# EAGLE design 280109_Button_PCB_4.0 (EAGLE 9.6.2)
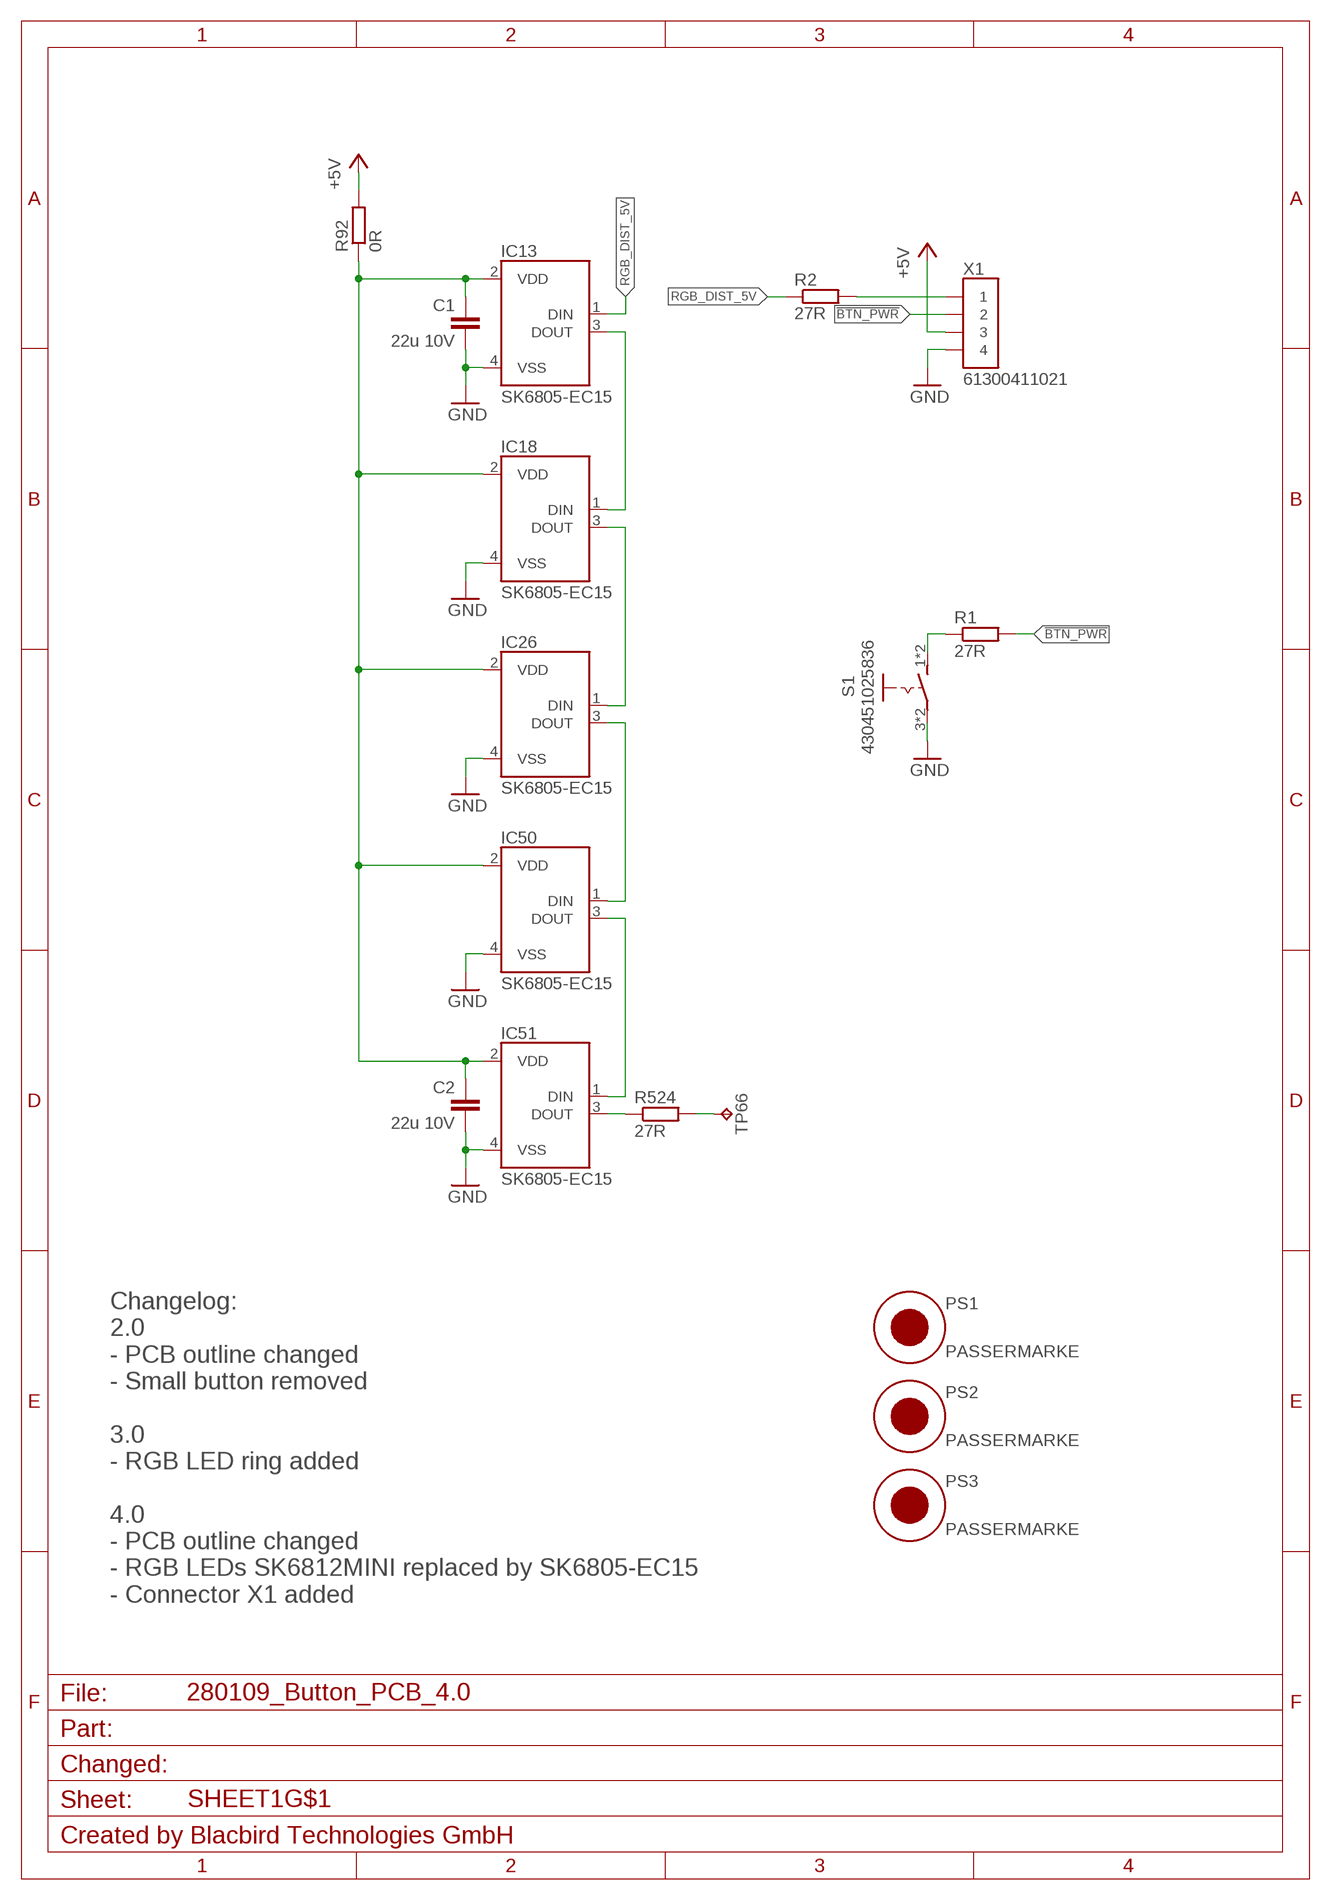
[diagram p0: schematic, sheet 1]

## Parts
C1  22u 10V  C-EUC0805  [C0805]
C2  22u 10V  C-EUC0805  [C0805]
IC13  SK6805-EC15  [SK6805-EC_IPIXEL]
IC18  SK6805-EC15  [SK6805-EC_IPIXEL]
IC26  SK6805-EC15  [SK6805-EC_IPIXEL]
IC50  SK6805-EC15  [SK6805-EC_IPIXEL]
IC51  SK6805-EC15  [SK6805-EC_IPIXEL]
PS1  PASSERMARKE  [PASSERMARKE]
PS2  PASSERMARKE  [PASSERMARKE]
PS3  PASSERMARKE  [PASSERMARKE]
R1  27R  R-EUR0603  [R0603]
R2  27R  R-EUR0603  [R0603]
R92  0R  R-EUR0603  [R0603]
R524  27R  R-EUR0603  [R0603]
S1  430451025836  [430451025836_WUERTH]
TP66  TESTPOINT_VIA_ROUND_0.8MM  [TESTVIA_ROUND_0.8MM]
X1  61300411021  [61300411021_WUERTH]

## Nets
!BTN_PWR: R1.2 X1.2
+5V: R92.2 X1.3
GND: C1.2 C2.2 IC13.4(VSS) IC18.4(VSS) IC26.4(VSS) IC50.4(VSS) IC51.4(VSS) S1.3(P) S1.4(P) X1.4
N$1: R1.1 S1.1(S) S1.2(S)
N$2: R2.2 X1.1
N$14: R524.2 TP66.P$1(TP)
N$21: C1.1 C2.1 IC13.2(VDD) IC18.2(VDD) IC26.2(VDD) IC50.2(VDD) IC51.2(VDD) R92.1
N$23: IC51.3(DOUT) R524.1
N$173: IC50.3(DOUT) IC51.1(DIN)
N$175: IC26.3(DOUT) IC50.1(DIN)
N$176: IC18.3(DOUT) IC26.1(DIN)
N$178: IC13.3(DOUT) IC18.1(DIN)
RGB_DIST_5V: IC13.1(DIN) R2.1

## Notes on the sheet
- Changelog:
  2.0
  - PCB outline changed
  - Small button removed
  
  3.0
  - RGB LED ring added
  
  4.0
  - PCB outline changed
  - RGB LEDs SK6812MINI replaced by SK6805-EC15
  - Connector X1 added

## Library data of the parts
C1 C2 = 03_DT_Passive_Components:C-EU: CAPACITOR, European symbol; CHANGED: 2017-09-12; CREATED: 2017-09-12; DIELECTRIC: X5R; MAX_OP_TEMP: 85°C; MIN_OP_TEMP: -55°C; STATUS: active; TOLERANCE: ±20 %; VOLTAGE: 10.0 V
IC13 IC18 IC26 IC50 IC51 = 2021_blacbird_eagle_lbr:SK6805-EC15: SK6805-EC15, Adafruit NeoPixel RGB LED, 1.50mm L x 1.50mm W Datasheet <https://cdn-shop.adafruit.com/product-files/4492/Datasheet.pdf>; CHANGED: 2021-10-20; CREATED: 2021-10-20; MANUFACTURER: IPIXELS; MAX_OP_TEMP: 85 °C; MIN_OP_TEMP: -40 °C; ROHS: yes; STATUS: active; VOLTAGE: 5.5 V
PS1-PS3 = 07_DT_Miscellaneous:PASSERMARKE; CHANGED: 2017-11-07; CREATED: 2017-11-07
R1 R2 R92 R524 = 03_DT_Passive_Components:R-EU: RESISTOR, European symbol; CHANGED: 2017-09-12; CREATED: 2017-09-12; MAX_OP_TEMP: 70 °C; MIN_OP_TEMP: -55 °C; POWER: 63 mW; STATUS: active; TEMP_COEFF: ±400 ppm/°C; TOLERANCE: ±1 %; VOLTAGE: 50 V
S1 = 05_DT_Electromechanic:430451025836: 430451025836, WS-TASV SMT Tact Switch; CHANGED: 2021-02-24; CREATED: 2021-02-24; CURRENT: 50 mA; MANUFACTURER: Wuerth; MAX_OP_TEMP: 85 °C; MIN_OP_TEMP: -40 °C; ROHS: yes; STATUS: active; VOLTAGE: 12.0 V
TP66 = 07_DT_Miscellaneous:TESTPOINT_VIA_ROUND_0.8MM: Testpoint THT Round 1.5 mm diameter, 0.8 mm hole; CHANGED: 2019-01-16; CREATED: 2019-01-16
X1 = 00_DT_Connectors:61300411021: 61300411021, WR-PHD, 2.54MM PIN HEADER angled, THT, 4 pins; CHANGED: 2021-11-17; CREATED: 2021-11-17; CURRENT: 3.0 A; MANUFACTURER: Wuerth; MAX_OP_TEMP: 105 °C; MIN_OP_TEMP: -40 °C; ROHS: yes; STATUS: active; VOLTAGE: 500 V(AC)

## Board
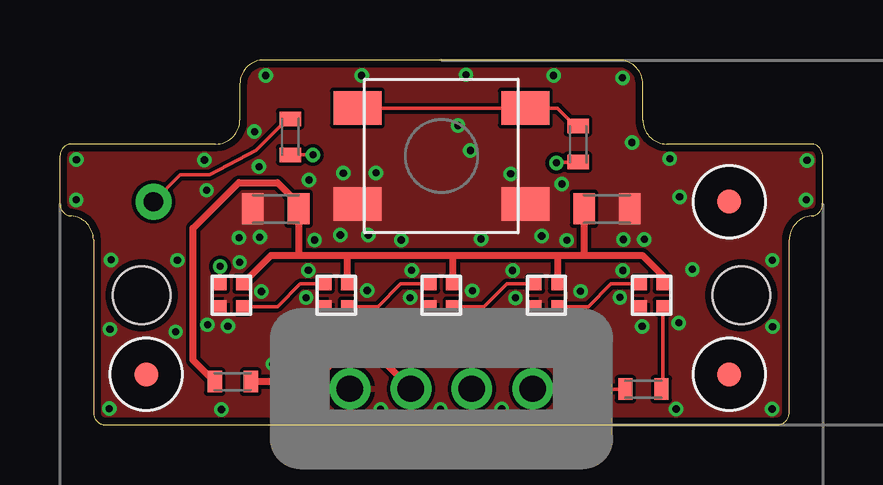
[diagram p1: board, top side]
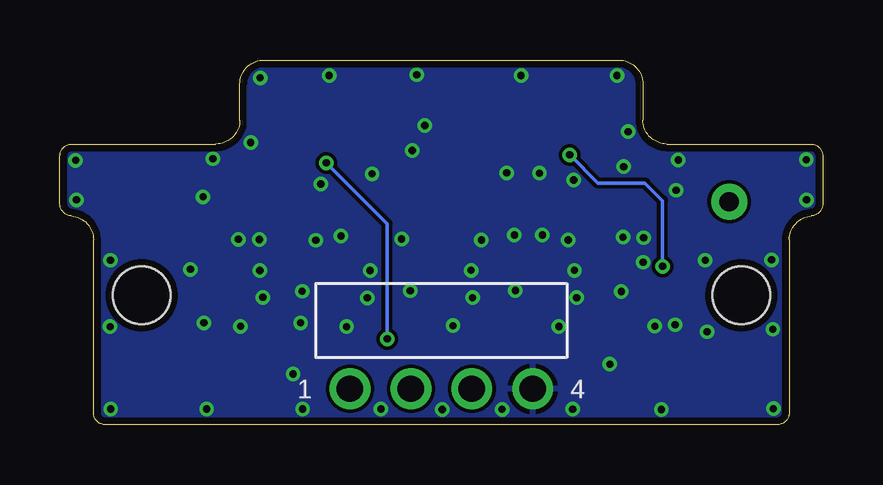
[diagram p2: board, bottom side, seen from below]

Size 31.8 x 15.2 mm. Coordinates in mm from the lower left corner, seen from the top.
Outline: 24.3,12.7 24.3,14.2 arc90 23.3,15.2 8.5,15.2 arc90 7.5,14.2 7.5,12.7 arc-90 6.5,11.7 0.5,11.7 arc90 0,11.2 0,9.2 arc86 0.47,8.7 arc-86 1.4,7.7 1.4,0.5 arc90 1.9,0 29.9,0 arc90 30.4,0.5 30.4,7.7 arc-86 31.33,8.7 arc86 31.8,9.2 31.8,11.2 arc90 31.3,11.7 25.3,11.7 arc-90 24.3,12.7
Copper layers (1*16): Top 0.035mm / dielectric 0.73mm / Bottom 0.035mm
Design rules "multi-cb_2L_035um-cu_150um_Strukturen *": minimum track width 0.15mm, minimum drill 0.3mm, track to track 0.15mm, track to pad 0.15mm, pad to pad 0.15mm, via to via 0.15mm, smd to smd 0.15mm, copper to edge 0.3mm, drill to drill 0.2mm, minimum pad ring 0.2mm, minimum via ring 0.15mm, stop-mask expansion 0.05mm, vias tented up to drill 0.3mm, thermal gap 8mil
Holes 2.4 mm at 3.4,5.4 28.4,5.4

### Footprints (pad centres in the part's own frame; a part is rotated, then mirrored left to right if it is on the bottom)
C0805 = smd 0.9 x 1.3: 1 -0.95,0; 2 0.95,0
SK6805-EC_IPIXEL = smd 0.55 x 0.55: 1 -0.475,0.475; 2 -0.475,-0.475; 3 0.475,-0.475; 4 0.475,0.475
PASSERMARKE = smd 1 x 1: P$1 0,0
R0603 = smd 0.6 x 0.9: 1 -0.75,0; 2 0.75,0
430451025836_WUERTH = smd 2 x 1.4: 1 -3.5,2; 2 3.5,2; 3 -3.5,-2; 4 3.5,-2
TESTVIA_ROUND_0.8MM = drill 0.8 pad 1.5: P$1 0,0
61300411021_WUERTH = drill 1.1 pad 1.7: 1 -3.81,0; 2 -1.27,0; 3 1.27,0; 4 3.81,0

### Placement (x,y rotation side)
C1  9,9 180 top
C2  22.8,9 0 top
IC13  24.66,5.4 180 top
IC18  20.28,5.4 180 top
IC26  15.9,5.4 180 top
IC50  11.52,5.4 180 top
IC51  7.14,5.4 180 top
PS1  27.9,2.1 0 top
PS2  27.9,9.3 0 top
PS3  3.6,2.1 0 top
R1  21.6,11.7 270 top
R2  24.32,1.48 180 top
R92  7.2,1.8 0 top
R524  9.6,12 90 top
S1  15.9,11.2 0 top
TP66  3.9,9.3 0 top
X1  15.9,1.5 0 bottom

### Tracks (layer width: path | path; a pad name or v marks a point on that pad's centre or on a via)
!BTN_PWR  (via drill 0.3)
  Top 0.15: X1.2 17.17,2.53 18.17,3.53 18.17,3.57 v18.16,3.58 | v20.7,10.91 20.73,10.95 R1.2
  Bottom 0.15: v18.16,3.58 18.16,8.38 v20.7,10.91
+5V
  Top 0.3: R92.2 10.58,1.8 11.57,2.79 13.35,2.79 X1.3
GND  (via drill 0.3)
  other vias: 24.27,4.1 23.35,5.31 18.99,5.29 19.85,4.09 14.6,5.3 15.42,4.13 10.26,5.3 11,4.1 6.15,4.17 7,4.11 8.4,5.56 12.82,5.6 17.2,5.59 21.7,5.57 18.87,6.43 23.47,6.43 14.66,6.44 10.35,6.44 7.46,7.79 8.33,7.82 7.49,6.77 10.62,7.7 17.56,7.74 21.13,7.69 23.49,7.72 24.36,7.73 14.23,7.7 11.81,10.49 13.17,10.5 11.69,7.91 12.86,7.91 18.79,10.46 20.92,10.03 20.08,7.87 8.58,14.55 16.93,14.58 12.58,14.55 20.58,14.55 23.45,14.46 23.85,11.76 25.42,11.08 31.15,11.02 31.11,9.37 29.7,6.86 29.71,4.09 29.68,0.66 25.68,0.66 21.68,0.66 18.42,0.66 15.86,0.64 13.37,0.64 10.43,0.65 2.05,0.67 6.73,0.63 2.08,3.98 2.13,6.87 0.68,9.37 0.69,11.05 6.02,11.03 8.11,12.22 6.11,9.77 8.3,10.76 10.38,10.2 4.9,6.86 4.82,3.88 8.88,2.53 22.08,2.12 21.77,4.25 25.8,4.25 26.36,6.48 25.84,9.5 17.11,11.43 16.6,12.47
  pour Top: 0,0 0,15.3 31.8,15.3 31.8,0
  pour Bottom: 0,0 0,15.3 31.8,15.3 31.8,0
  pour Top (no thermals): -0.6,-0.9 -0.6,16.2 32.7,16.2 32.7,-1.2 30,-1.2 13.5,-1.2 13.5,2.7 10.8,2.7 10.8,0.3 10.8,-0.9
N$1
  Top 0.15: S1.1 S1.2 20.74,13.2 21.49,12.45 R1.1
N$2
  Top 0.15: R2.2 19.71,1.48 X1.1
N$14
  Top 0.15: TP66.P$1 5.01,10.41 6.23,10.41 8.17,11.43 9.49,12.75 R524.2
N$21
  Top 0.3: IC13.2 25.13,6.21 24.29,7.06 21.85,7.06 | 20.8,7.06 21.85,7.06 | IC18.2 20.76,7.01 20.8,7.06 | C2.1 21.85,7.06 | R92.1 5.55,2.7 5.55,8.19 7.45,10.09 9.07,10.09 9.95,9.21 C1.1 9.95,7.06 | IC51.2 8.8,7.06 9.95,7.06 | 9.95,7.06 12,7.06 | 12,7.06 16.38,7.06 | 20.8,7.06 16.67,7.06 16.38,7.06 | IC50.2 12,7.06 | IC26.2 16.38,7.06
N$23  (via drill 0.3)
  Top 0.15: IC51.3 6.67,6.59 v6.68,6.6 | v10.55,11.25 R524.1
  Bottom 0.15: v6.68,6.6 6.68,9.34 7.41,10.07 9.38,10.07 v10.55,11.25
N$173
  Top 0.15: IC51.1 9.07,4.93 10.02,5.88 IC50.3
N$175
  Top 0.15: IC50.1 13.26,4.93 14.21,5.88 IC26.3
N$176
  Top 0.15: IC26.1 17.68,4.93 18.63,5.88 IC18.3
N$178
  Top 0.15: IC18.1 22.03,4.93 22.98,5.88 IC13.3
RGB_DIST_5V
  Top 0.15: R2.1 25.13,1.48 IC13.1

### Text on the board
bStop: 280109 / Button PCB 4.0